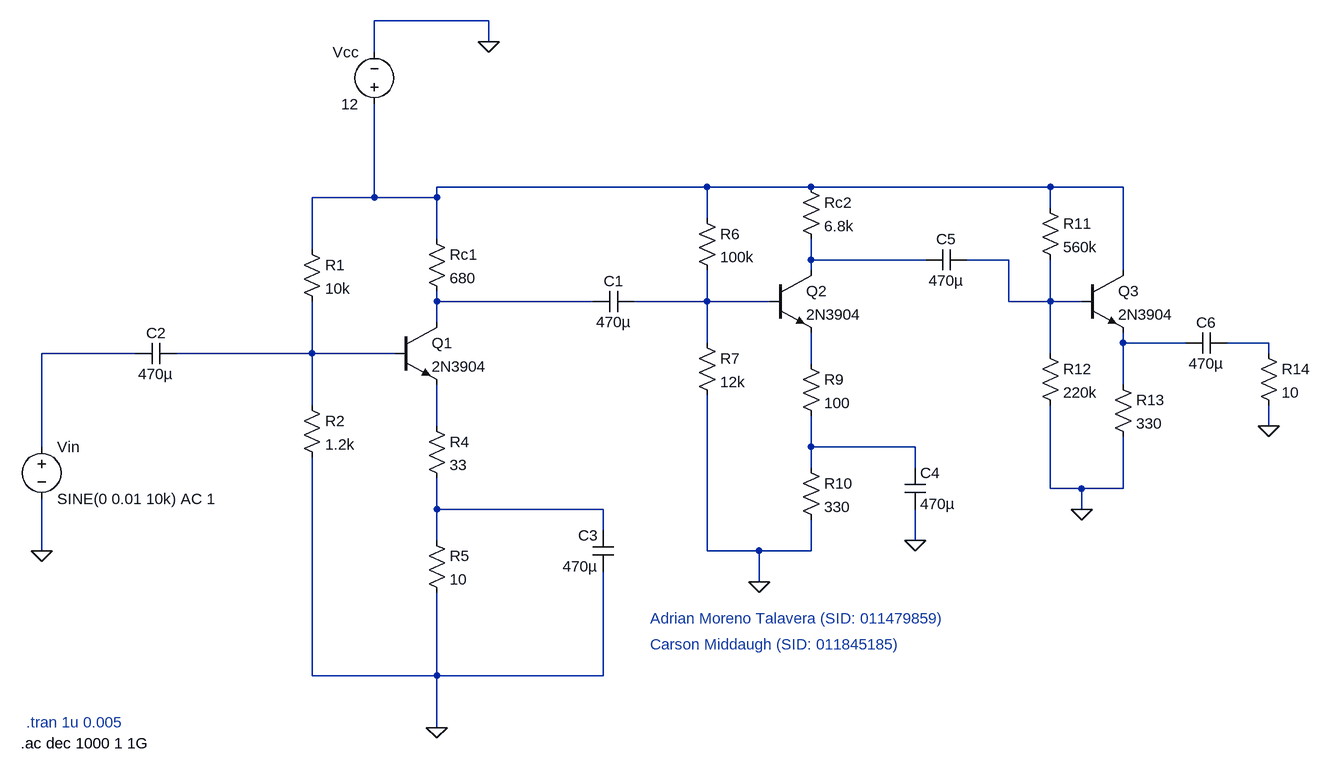
[diagram p0: schematic Design_Project_Working_ImpedanceBridging.asc]
Design_Project_Working_ImpedanceBridging.asc, the LTspice schematic file:
Version 4.1
SHEET 1 1668 840
WIRE 400 -288 224 -288
WIRE 400 -256 400 -288
WIRE 224 -240 224 -288
WIRE 736 -32 320 -32
WIRE 896 -32 736 -32
WIRE 1264 -32 896 -32
WIRE 1376 -32 1264 -32
WIRE 224 -16 224 -160
WIRE 224 -16 128 -16
WIRE 320 -16 320 -32
WIRE 320 -16 224 -16
WIRE 1264 0 1264 -32
WIRE 736 16 736 -32
WIRE 320 48 320 -16
WIRE 128 64 128 -16
WIRE 896 80 896 48
WIRE 1072 80 896 80
WIRE 1200 80 1136 80
WIRE 896 96 896 80
WIRE 1376 96 1376 -32
WIRE 320 144 320 128
WIRE 560 144 320 144
WIRE 736 144 736 96
WIRE 736 144 624 144
WIRE 832 144 736 144
WIRE 1200 144 1200 80
WIRE 1264 144 1264 80
WIRE 1264 144 1200 144
WIRE 1312 144 1264 144
WIRE 320 176 320 144
WIRE 736 208 736 144
WIRE 1376 208 1376 192
WIRE 1472 208 1376 208
WIRE 1600 208 1536 208
WIRE -144 224 -288 224
WIRE 128 224 128 144
WIRE 128 224 -80 224
WIRE 256 224 128 224
WIRE 1264 224 1264 144
WIRE 1600 224 1600 208
WIRE 896 240 896 192
WIRE 1376 272 1376 208
WIRE 128 304 128 224
WIRE 320 336 320 272
WIRE 1600 336 1600 304
WIRE -288 368 -288 224
WIRE 896 368 896 320
WIRE 1056 368 896 368
WIRE 896 400 896 368
WIRE 1056 400 1056 368
WIRE 1264 432 1264 304
WIRE 1312 432 1264 432
WIRE 1376 432 1376 352
WIRE 1376 432 1312 432
WIRE 320 464 320 416
WIRE 576 464 320 464
WIRE 1312 464 1312 432
WIRE 576 496 576 464
WIRE 320 512 320 464
WIRE 1056 512 1056 464
WIRE -288 528 -288 448
WIRE 736 528 736 288
WIRE 816 528 736 528
WIRE 896 528 896 480
WIRE 896 528 816 528
WIRE 816 576 816 528
WIRE 128 720 128 384
WIRE 320 720 320 592
WIRE 320 720 128 720
WIRE 576 720 576 560
WIRE 576 720 320 720
WIRE 320 800 320 720
FLAG 320 800 0
FLAG -288 528 0
FLAG 400 -256 0
FLAG 1056 512 0
FLAG 816 576 0
FLAG 1312 464 0
FLAG 1600 336 0
SYMBOL res 112 48 R0
SYMATTR InstName R1
SYMATTR Value 10k
SYMBOL res 112 288 R0
SYMATTR InstName R2
SYMATTR Value 1.2k
SYMBOL npn 256 176 R0
SYMATTR InstName Q1
SYMATTR Value 2N3904
SYMBOL res 304 32 R0
SYMATTR InstName Rc1
SYMATTR Value 680
SYMBOL res 304 320 R0
SYMATTR InstName R4
SYMATTR Value 33
SYMBOL res 304 496 R0
SYMATTR InstName R5
SYMATTR Value 10
SYMBOL cap -80 208 R90
WINDOW 0 0 32 VBottom 2
WINDOW 3 32 32 VTop 2
SYMATTR InstName C2
SYMATTR Value 470µ
SYMBOL cap 592 560 R180
WINDOW 0 24 56 Left 2
WINDOW 3 24 8 Left 2
SYMATTR InstName C3
SYMATTR Value 470µ
SYMBOL cap 624 128 R90
WINDOW 0 0 32 VBottom 2
WINDOW 3 32 32 VTop 2
SYMATTR InstName C1
SYMATTR Value 470µ
SYMBOL voltage -288 352 R0
WINDOW 123 0 0 Left 0
WINDOW 39 0 0 Left 0
SYMATTR InstName Vin
SYMATTR Value SINE(0 0.01 10k) AC 1
SYMBOL voltage 224 -144 R180
WINDOW 0 24 96 Left 2
WINDOW 3 24 16 Left 2
WINDOW 123 0 0 Left 0
WINDOW 39 0 0 Left 0
SYMATTR InstName Vcc
SYMATTR Value 12
SYMBOL res 720 0 R0
SYMATTR InstName R6
SYMATTR Value 100k
SYMBOL res 720 192 R0
SYMATTR InstName R7
SYMATTR Value 12k
SYMBOL npn 832 96 R0
SYMATTR InstName Q2
SYMATTR Value 2N3904
SYMBOL res 880 -48 R0
SYMATTR InstName Rc2
SYMATTR Value 6.8k
SYMBOL res 880 224 R0
SYMATTR InstName R9
SYMATTR Value 100
SYMBOL res 880 384 R0
SYMATTR InstName R10
SYMATTR Value 330
SYMBOL cap 1040 400 R0
SYMATTR InstName C4
SYMATTR Value 470µ
SYMBOL cap 1136 64 R90
WINDOW 0 0 32 VBottom 2
WINDOW 3 32 32 VTop 2
SYMATTR InstName C5
SYMATTR Value 470µ
SYMBOL npn 1312 96 R0
SYMATTR InstName Q3
SYMATTR Value 2N3904
SYMBOL res 1248 -16 R0
SYMATTR InstName R11
SYMATTR Value 560k
SYMBOL res 1248 208 R0
SYMATTR InstName R12
SYMATTR Value 220k
SYMBOL res 1360 256 R0
SYMATTR InstName R13
SYMATTR Value 330
SYMBOL res 1584 208 R0
SYMATTR InstName R14
SYMATTR Value 10
SYMBOL cap 1536 192 R90
WINDOW 0 0 32 VBottom 2
WINDOW 3 32 32 VTop 2
SYMATTR InstName C6
SYMATTR Value 470µ
TEXT -320 824 Left 2 !.ac dec 1000 1 1G
TEXT -312 792 Left 2 ;.tran 1u 0.005
TEXT 648 632 Left 2 ;Adrian Moreno Talavera (SID: 011479859)
TEXT 648 672 Left 2 ;Carson Middaugh (SID: 011845185)

The netlist it stands for:
* Design_Project_Working_ImpedanceBridging.asc
R1 N001 N009 10k
R2 N009 0 1.2k
Q1 N004 N009 N011 0 2N3904
Rc1 N001 N004 680
R4 N011 N013 33
R5 N013 0 10
C2 N009 N008 470µ
C3 0 N013 470µ
C1 N005 N004 470µ
Vin N008 0 SINE(0 0.01 10k) AC 1
Vcc N001 0 12
R6 N001 N005 100k
R7 N005 0 12k
Q2 N002 N005 N010 0 2N3904
Rc2 N001 N002 6.8k
R9 N010 N012 100
R10 N012 0 330
C4 N012 0 470µ
C5 N003 N002 470µ
Q3 N001 N003 N006 0 2N3904
R11 N001 N003 560k
R12 N003 0 220k
R13 N006 0 330
R14 N007 0 10
C6 N007 N006 470µ
.model NPN NPN
.model PNP PNP
.lib standard.bjt
.ac dec 1000 1 1G
* .tran 1u 0.005
* Adrian Moreno Talavera (SID: 011479859)
* Carson Middaugh (SID: 011845185)
.backanno
.end